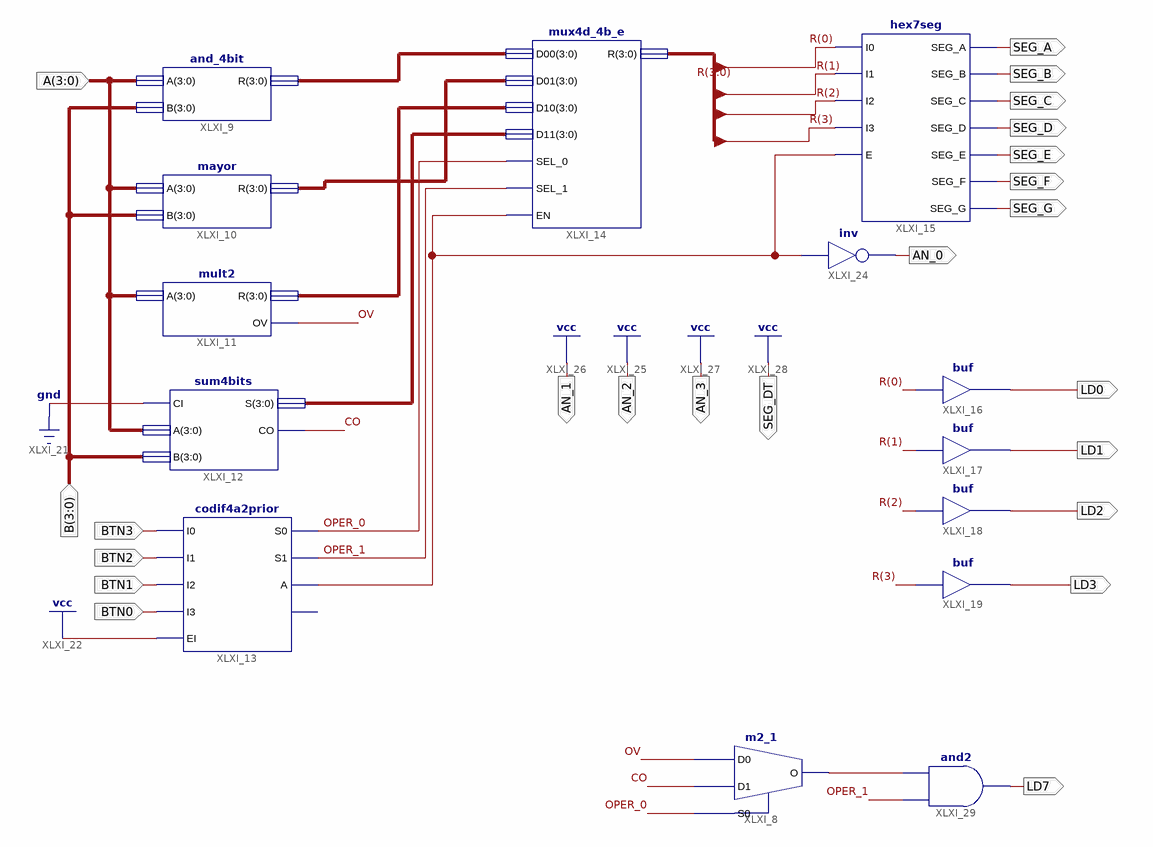
[diagram p0: schematic sheet 1]
// Xilinx ISE schematic top_alu.sch (spartan3e) as structural Verilog: 14 symbols, 23 ports
module top_alu (
  input  [3:0] A,
  input  [3:0] B,
  input  BTN3,
  input  BTN2,
  input  BTN1,
  input  BTN0,
  output AN_0,
  output SEG_A,
  output SEG_B,
  output SEG_C,
  output SEG_D,
  output SEG_E,
  output SEG_F,
  output SEG_G,
  output LD0,
  output LD1,
  output LD2,
  output LD3,
  output AN_1,
  output AN_2,
  output AN_3,
  output SEG_DT,
  output LD7
);

  wire CO, OPER_0, OPER_1, OV, XLXN_8, XLXN_57;
  wire [3:0] R, XLXN_1, XLXN_5, XLXN_10, XLXN_11;

  m2_1 XLXI_8 (.D0(OV), .D1(CO), .S0(OPER_0), .O(XLXN_57));
  and_4bit XLXI_9 (.A(A), .B(B), .R(XLXN_1));
  mayor XLXI_10 (.A(A), .B(B), .R(XLXN_10));
  mult2 XLXI_11 (.A(A), .OV(OV), .R(XLXN_11));
  sum4bits XLXI_12 (.A(A), .B(B), .CI(1'b0), .CO(CO), .S(XLXN_5));
  codif4a2prior XLXI_13 (
    .A(XLXN_8), .EI(1'b1), .I0(BTN3), .I1(BTN2), .I2(BTN1), .I3(BTN0), .S0(OPER_0), .S1(OPER_1));  // open: E0
  mux4d_4b_e XLXI_14 (
    .D00(XLXN_1), .D01(XLXN_10), .D10(XLXN_11), .D11(XLXN_5), .EN(XLXN_8), .R(R), .SEL_0(OPER_0),
    .SEL_1(OPER_1));
  hex7seg XLXI_15 (
    .E(XLXN_8), .I0(R[0]), .I1(R[1]), .I2(R[2]), .I3(R[3]), .SEG_A(SEG_A), .SEG_B(SEG_B), .SEG_C(SEG_C),
    .SEG_D(SEG_D), .SEG_E(SEG_E), .SEG_F(SEG_F), .SEG_G(SEG_G));
  buf XLXI_16 (LD0, R[0]);
  buf XLXI_17 (LD1, R[1]);
  buf XLXI_18 (LD2, R[2]);
  buf XLXI_19 (LD3, R[3]);
  not XLXI_24 (AN_0, XLXN_8);
  and XLXI_29 (LD7, OPER_1, XLXN_57);

  assign AN_1 = 1'b1;
  assign AN_2 = 1'b1;
  assign AN_3 = 1'b1;
  assign SEG_DT = 1'b1;
endmodule
